# Altium schematic sheet MAZ000182 - Diagrama físico.SchDoc: MAZ000182 - Diagrama físico
size A; ApprovedBy: Christian Ledwidth; CheckedBy: Nahuel Martinez; Author: Santiago Marti; CompanyName: Body Health; DrawnBy: Santiago Marti; Revision: A; SheetNumber: 2; SheetTotal: 2
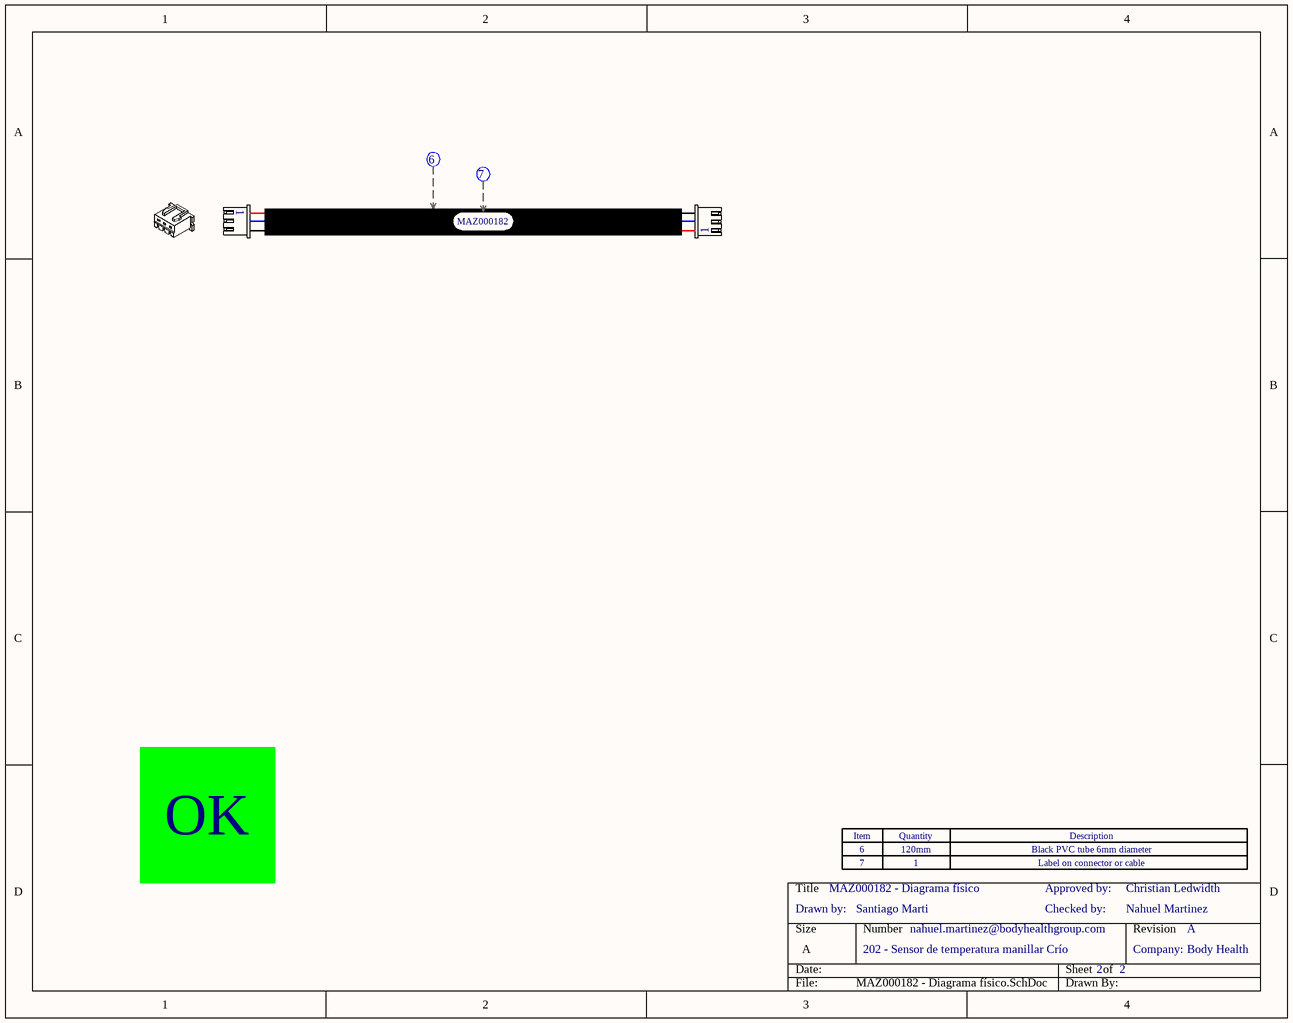
[diagram p0: MAZ000182 - Diagrama físico.SchDoc]

## Parts
(Parts that share a designator on the sheet are numbered #1, #2 ... from top to bottom, then left to right.)
Con?#1  XHP-3  (value not drawn)  (part A of 4)
Con?#2  XHP-3  (value not drawn)  (part A of 4)
Con?#3  XHP-3  (value not drawn)  (part B of 4)
Eti?  Etiqueta  (value not drawn)
Ter1  Termocontraible  (value not drawn)
Zoc1  Zócalo_Header  (value not drawn)
Zoc10  Zócalo_Item  (value not drawn)
Zoc11  Zócalo_Item  (value not drawn)

## Notes on the sheet
- MAZ000182
- OK
- Drawn by:
- 7
- 6
- 1
- 120mm
- Checked by:
- Approved by:
- Label on connector or cable
- Black PVC tube 6mm diameter
- 202 - Sensor de temperatura manillar Crío
- nahuel.martinez@bodyhealthgroup.com
- Company:
- (in symbol Zócalo_Header) Item; Quantity; Description

## Library data of the parts
Con?#1-Con?#3 = XHP-3: CONN HOUSING 2.5MM 3POS; Fabricante: JST Sales America Inc.; Cod.DigiKey: 455-2219-ND; Cod.Fabricante: XHP-3; ComponentLink1Description: Manufacturer Link; ComponentLink1URL: http://www.jst-mfg.com/product/pdf/eng/eXH.pdf; DIGIKEYx50: 0.06220; CallOut: *; DIGIKEYx100: NO
Eti? = Etiqueta: CallOut: 7; Texto: *
Ter1 = Termocontraible: CallOut: 6; Largo: *; Diámetro: *
Zoc1 = Zócalo_Header: Header para el zócalo de referencias
Zoc10 Zoc11 = Zócalo_Item: Ítem para el zócalo de referencias; Desginator: *; Quantity: *; ItemDescription: *